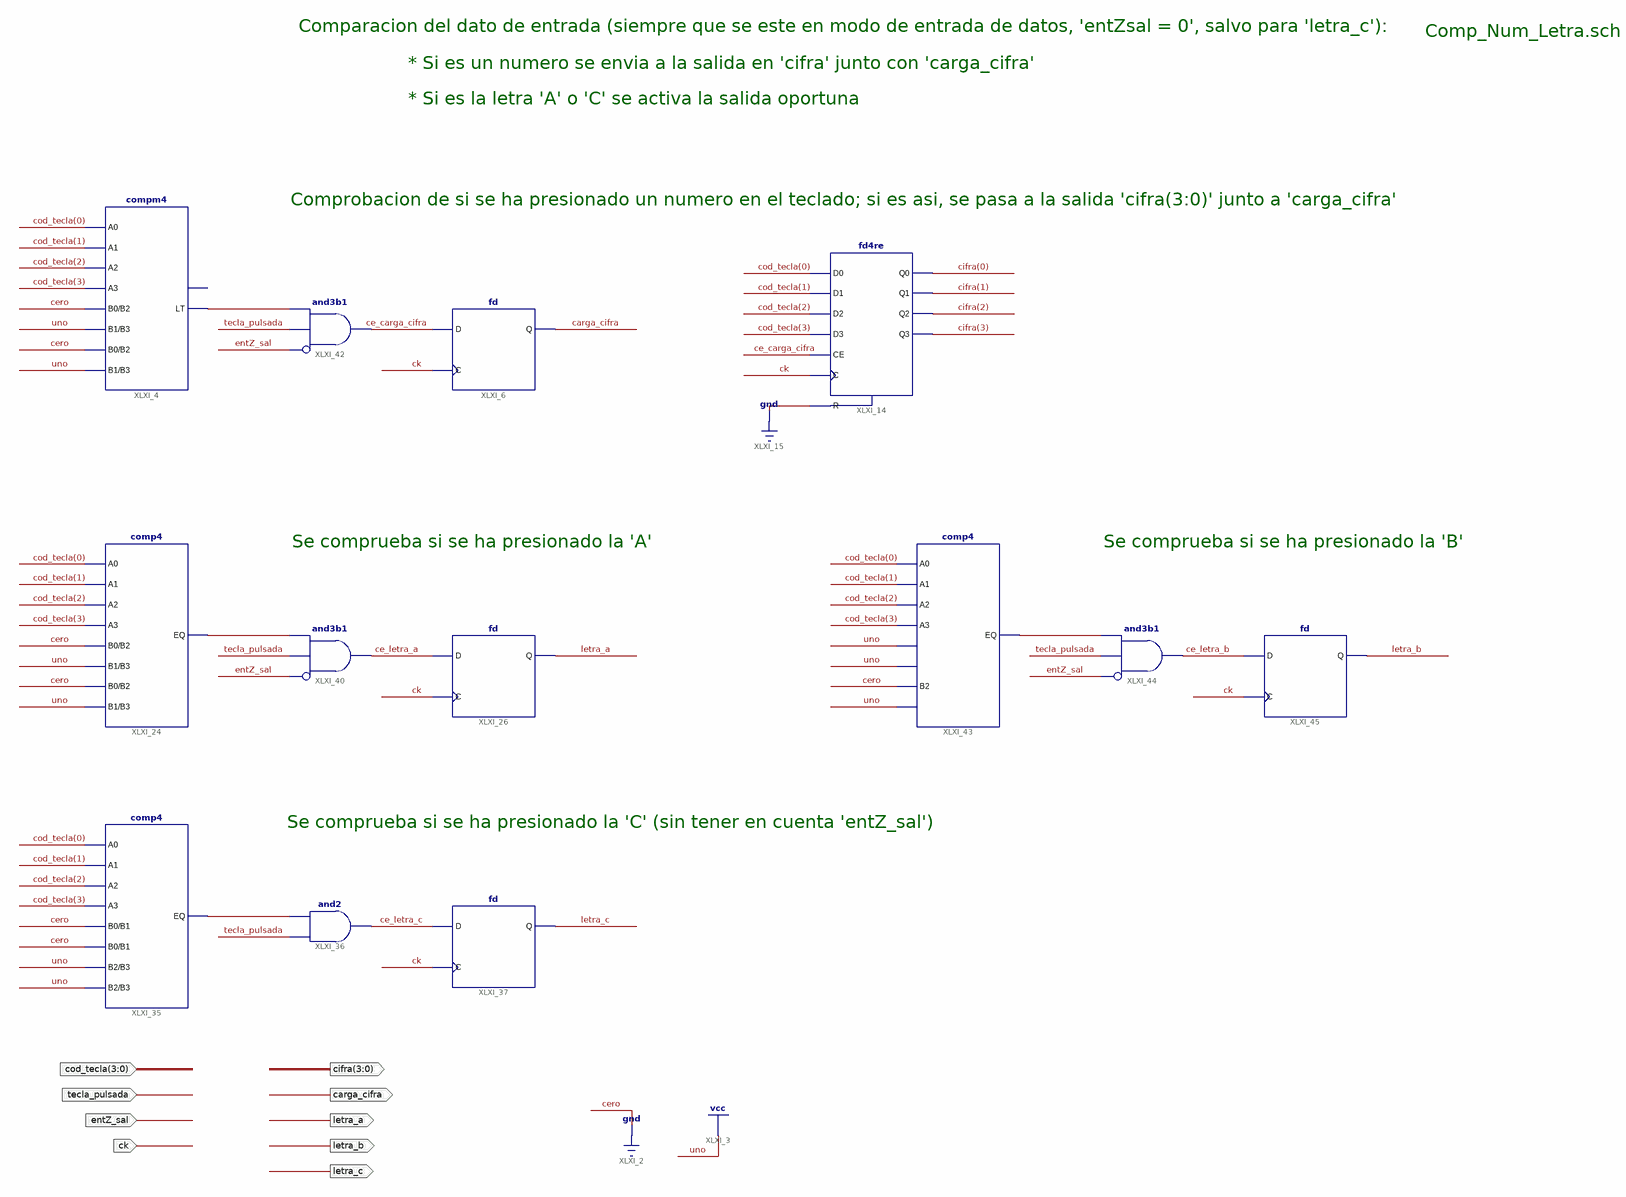
[diagram p0: schematic sheet 1]
// Xilinx ISE schematic Comp_Num_Letra.sch (spartan6) as structural Verilog: 13 symbols, 9 ports
module Comp_Num_Letra (
  input  tecla_pulsada,
  input  ck,
  input  [3:0] cod_tecla,
  input  entZ_sal,
  output carga_cifra,
  output letra_a,
  output letra_c,
  output [3:0] cifra,
  output letra_b
);

  wire ce_carga_cifra, ce_letra_a, ce_letra_b, ce_letra_c, XLXN_19, XLXN_169, XLXN_170, XLXN_181;

  comp4 XLXI_24 (
    .A0(cod_tecla[0]), .A1(cod_tecla[1]), .A2(cod_tecla[2]), .A3(cod_tecla[3]), .B0(1'b0), .B1(1'b1),
    .B2(1'b0), .B3(1'b1), .EQ(XLXN_169));
  compm4 XLXI_4 (
    .A0(cod_tecla[0]), .A1(cod_tecla[1]), .A2(cod_tecla[2]), .A3(cod_tecla[3]), .B0(1'b0), .B1(1'b1),
    .B2(1'b0), .B3(1'b1), .LT(XLXN_19));  // open: GT
  fd4re XLXI_14 (
    .C(ck), .CE(ce_carga_cifra), .D0(cod_tecla[0]), .D1(cod_tecla[1]), .D2(cod_tecla[2]), .D3(cod_tecla[3]),
    .R(1'b0), .Q0(cifra[0]), .Q1(cifra[1]), .Q2(cifra[2]), .Q3(cifra[3]));
  comp4 XLXI_35 (
    .A0(cod_tecla[0]), .A1(cod_tecla[1]), .A2(cod_tecla[2]), .A3(cod_tecla[3]), .B0(1'b0), .B1(1'b0),
    .B2(1'b1), .B3(1'b1), .EQ(XLXN_170));
  fd XLXI_37 (.C(ck), .D(ce_letra_c), .Q(letra_c));
  and XLXI_36 (ce_letra_c, tecla_pulsada, XLXN_170);
  and XLXI_40 (ce_letra_a, ~entZ_sal, tecla_pulsada, XLXN_169);  // and3b1
  fd XLXI_26 (.C(ck), .D(ce_letra_a), .Q(letra_a));
  and XLXI_42 (ce_carga_cifra, ~entZ_sal, tecla_pulsada, XLXN_19);  // and3b1
  fd XLXI_6 (.C(ck), .D(ce_carga_cifra), .Q(carga_cifra));
  comp4 XLXI_43 (
    .A0(cod_tecla[0]), .A1(cod_tecla[1]), .A2(cod_tecla[2]), .A3(cod_tecla[3]), .B0(1'b1), .B1(1'b1),
    .B2(1'b0), .B3(1'b1), .EQ(XLXN_181));
  and XLXI_44 (ce_letra_b, ~entZ_sal, tecla_pulsada, XLXN_181);  // and3b1
  fd XLXI_45 (.C(ck), .D(ce_letra_b), .Q(letra_b));

  // Notes on the sheet:
  //   Comparacion del dato de entrada (siempre que se este en modo de entrada de datos, 'entZsal = 0', salvo para 'letra_c'):
  //   Comp_Num_Letra.sch
  //   * Si es un numero se envia a la salida en 'cifra' junto con 'carga_cifra'
  //   * Si es la letra 'A' o 'C' se activa la salida oportuna
  //   Comprobacion de si se ha presionado un numero en el teclado; si es asi, se pasa a la salida 'cifra(3:0)' junto a 'carga_cifra'
  //   Se comprueba si se ha presionado la 'A'
  //   Se comprueba si se ha presionado la 'B'
  //   Se comprueba si se ha presionado la 'C' (sin tener en cuenta 'entZ_sal')
endmodule
